# EAGLE schematic schematic_001 (EAGLE 9.6.2)
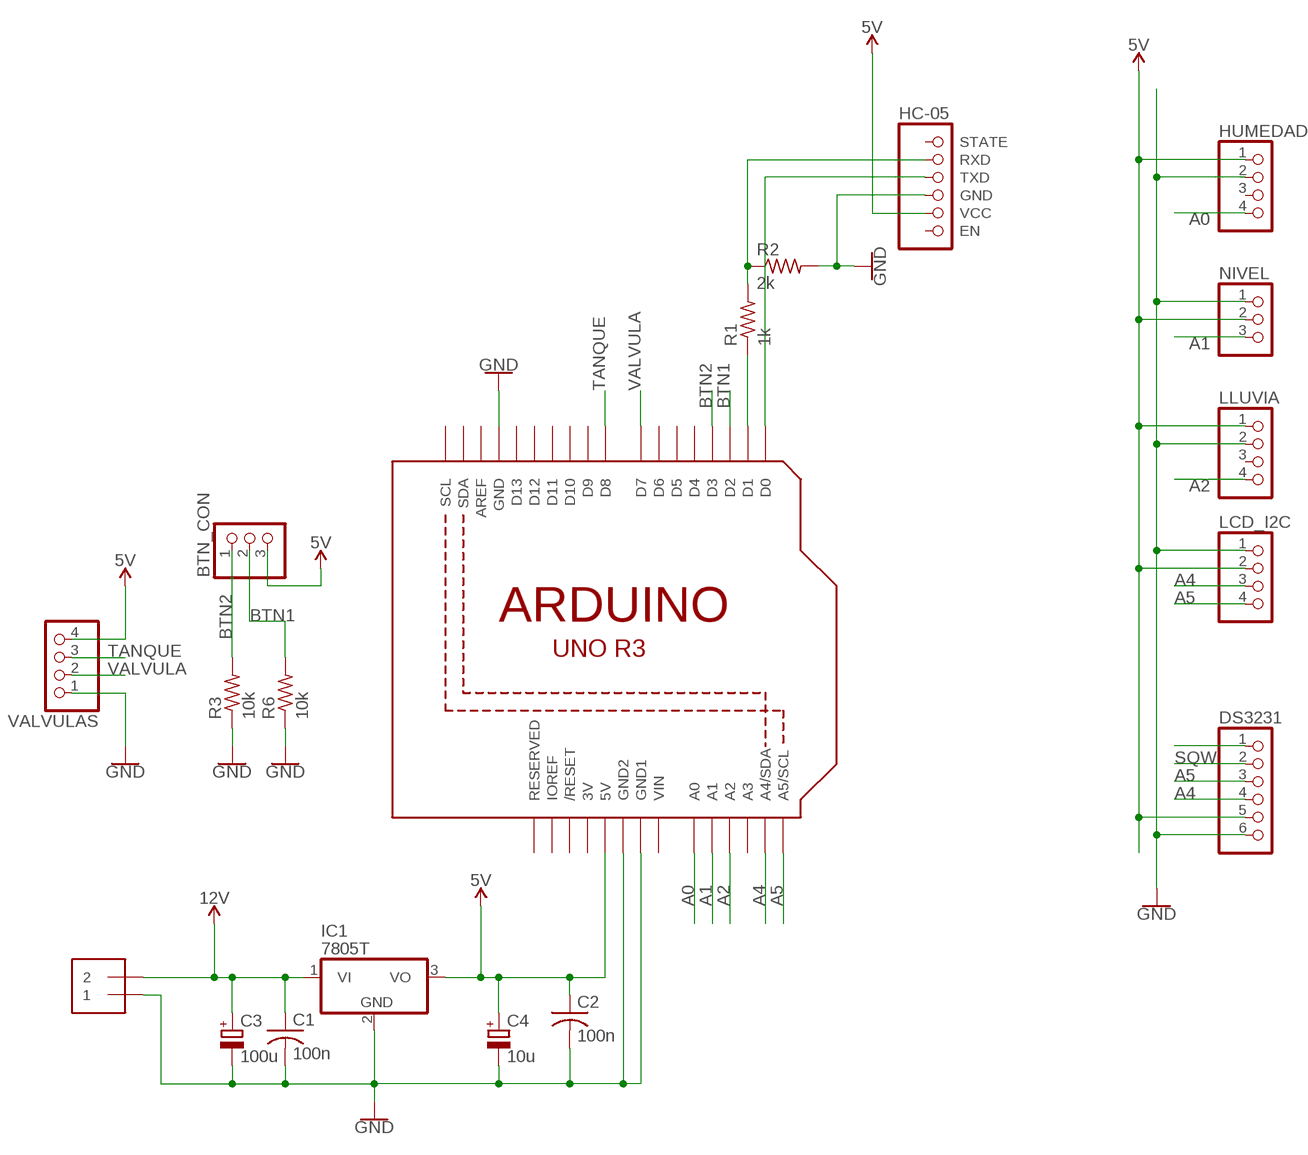
[diagram p0: schematic, sheet 1]

## Parts
BTN_CON  PINHD-1X3  [1X03]
C1  100n  C-US050-024X044  [C050-024X044]
C2  100n  C-US050-024X044  [C050-024X044]
C3  100u  CPOL-EUE2.5-7  [E2,5-7]
C4  10u  CPOL-EUE2.5-7  [E2,5-7]
DS3231  PINHD-1X6  [1X06]
HC-05  HC-05  [1X06]
HUMEDAD  PINHD-1X4  [1X04]
IC1  7805T  [TO220H]
J1  1X2-3.5MM  [1X2-3.5MM]
LCD_I2C  PINHD-1X4  [1X04]
LLUVIA  PINHD-1X4  [1X04]
NIVEL  PINHD-1X3  [1X03]
R1  1k  R-US_0204/7  [0204/7]
R2  2k  R-US_0204/7  [0204/7]
R3  10k  R-US_0204/7  [0204/7]
R6  10k  R-US_0204/7  [0204/7]
U1  ARDUINOR3-BPLACE  [ARDUINOR3-BPLACE]
VALVULAS  PINHD-1X4  [1X04]

## Nets
5V: BTN_CON.3 C2.1 C4.+ DS3231.5 HC-05.5(VCC) HUMEDAD.1 IC1.3(VO) LCD_I2C.2 LLUVIA.1 NIVEL.2 U1.5V VALVULAS.4
12V: C1.1 C3.+ IC1.1(VI) J1.2
A0: HUMEDAD.4 U1.A0
A1: NIVEL.3 U1.A1
A2: LLUVIA.4 U1.A2
A4: DS3231.4 LCD_I2C.3 U1.A4(A4/SDA)
A5: DS3231.3 LCD_I2C.4 U1.A5(A5/SCL)
BTN1: BTN_CON.2 R6.2 U1.D2
BTN2: BTN_CON.1 R3.2 U1.D3
GND: C1.2 C2.2 C3.- C4.- DS3231.6 HC-05.4(GND) HUMEDAD.2 IC1.2(GND) J1.1 LCD_I2C.1 LLUVIA.2 NIVEL.1 R2.2 R3.1 R6.1 U1.GND U1.GND1 U1.GND2 VALVULAS.1
N$2: HC-05.2(RXD) R1.2 R2.1
N$3: R1.1 U1.D1
N$4: HC-05.3(TXD) U1.D0
N$6: DS3231.1
SQW: DS3231.2
TANQUE: U1.D8 VALVULAS.3
VALVULA: U1.D7 VALVULAS.2
Unconnected: HC-05.1(STATE) HC-05.6(EN) HUMEDAD.3 LLUVIA.3 U1.A3 U1.AREF U1.D4 U1.D5 U1.D6 U1.D9 U1.D10 U1.D11 U1.D12 U1.D13 U1.IOREF U1.RESERVED U1.RESET(/RESET) U1.SCL U1.SDA

## Power pins joined to a net without a drawn wire
3V: U1.3V
VIN: U1.VIN

## Library data of the parts
BTN_CON NIVEL = daveware_2020:PINHD-1X3: PIN HEADER
C1 C2 = rcl:C-US: CAPACITOR, American symbol; SPICEPREFIX: C
C3 C4 = rcl:CPOL-EU: POLARIZED CAPACITOR, European symbol; SPICEPREFIX: C
DS3231 = daveware_2020:PINHD-1X6: PIN HEADER
HC-05 = daveware_2020:HC-05: BLUETOOTH HC-05; BLUETOOTH: HC-05
HUMEDAD LCD_I2C LLUVIA VALVULAS = pinhead:PINHD-1X4: PIN HEADER
IC1 = daveware_2020:78*: Positive VOLTAGE REGULATOR Added bigger pads to the TO-92 package
J1 = daveware_2020:1X2: 3.5mm Terminal block http://www.ladyada.net/library/pcb/eaglelibrary.html
R1-R3 R6 = daveware_2020:R-US_: RESISTOR, American symbol
U1 = daveware_2020:ARDUINOR3: This is a new object for the new Arduino R3 - with extra pins that you may want to use (such as IOref, and duplicated A4/A5